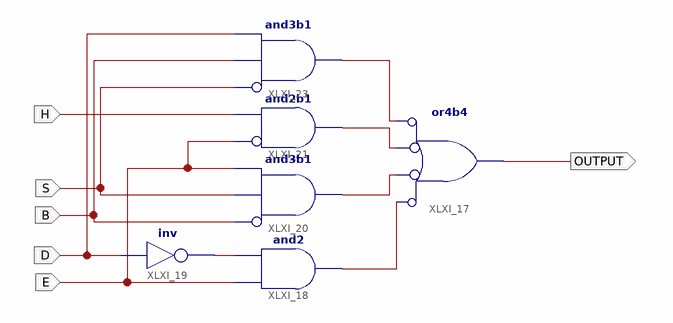
[diagram p0: schematic sheet 1]
// Xilinx ISE schematic LAB_0.sch (spartan6) as structural Verilog: 6 symbols, 6 ports
module LAB_0 (
  input  D,
  input  B,
  input  S,
  input  H,
  input  E,
  output OUTPUT
);

  wire XLXN_23, XLXN_45, XLXN_46, XLXN_47, XLXN_48;

  and XLXI_18 (XLXN_48, E, XLXN_23);
  not XLXI_19 (XLXN_23, D);
  or XLXI_17 (OUTPUT, ~XLXN_48, ~XLXN_47, ~XLXN_46, ~XLXN_45);  // or4b4
  and XLXI_21 (XLXN_46, ~E, H);  // and2b1
  and XLXI_23 (XLXN_45, ~S, B, D);  // and3b1
  and XLXI_20 (XLXN_47, ~B, S, E);  // and3b1
endmodule
